# Altium schematic sheet NET.SchDoc
size 558 x 431 mm
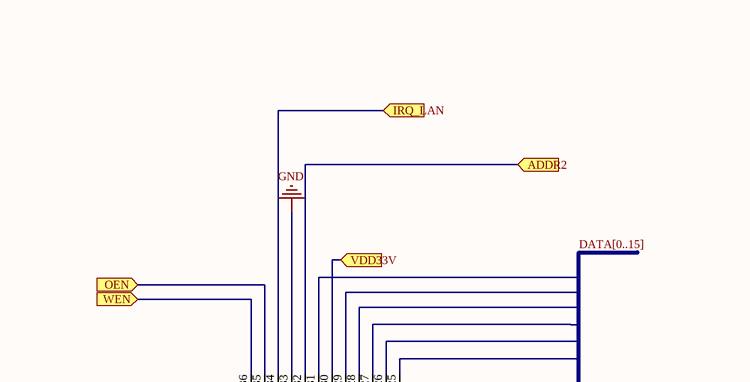
[diagram p0: NET.SchDoc, top left]
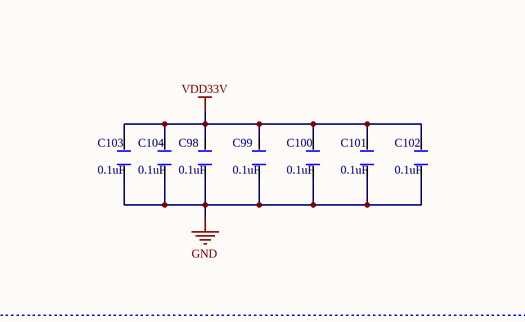
[diagram p1: NET.SchDoc, top right]
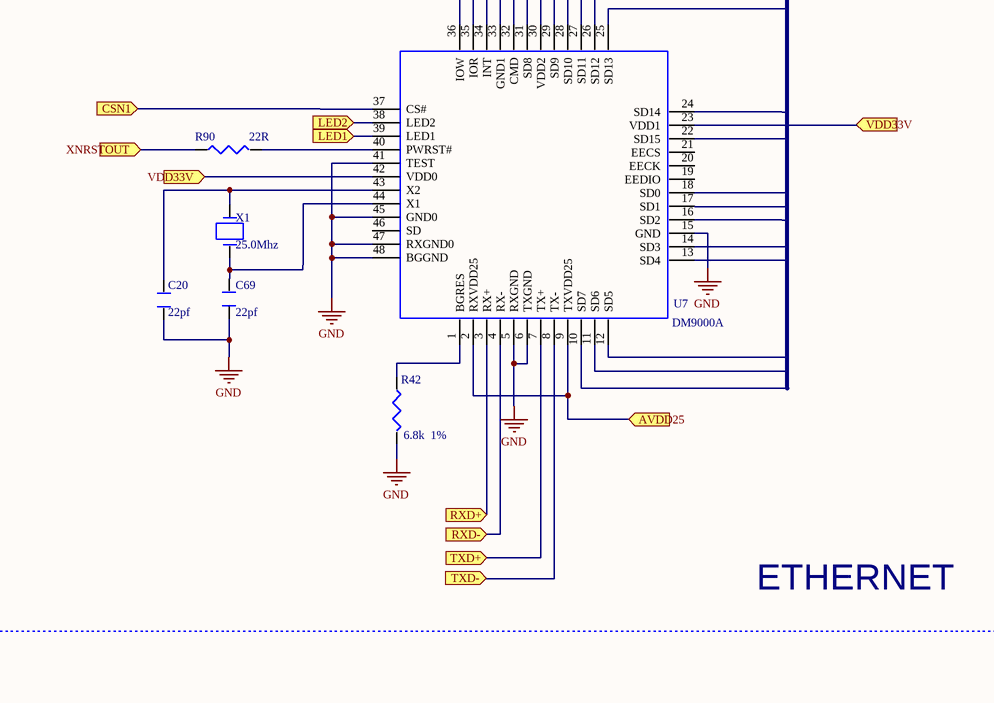
[diagram p2: NET.SchDoc, bottom left]
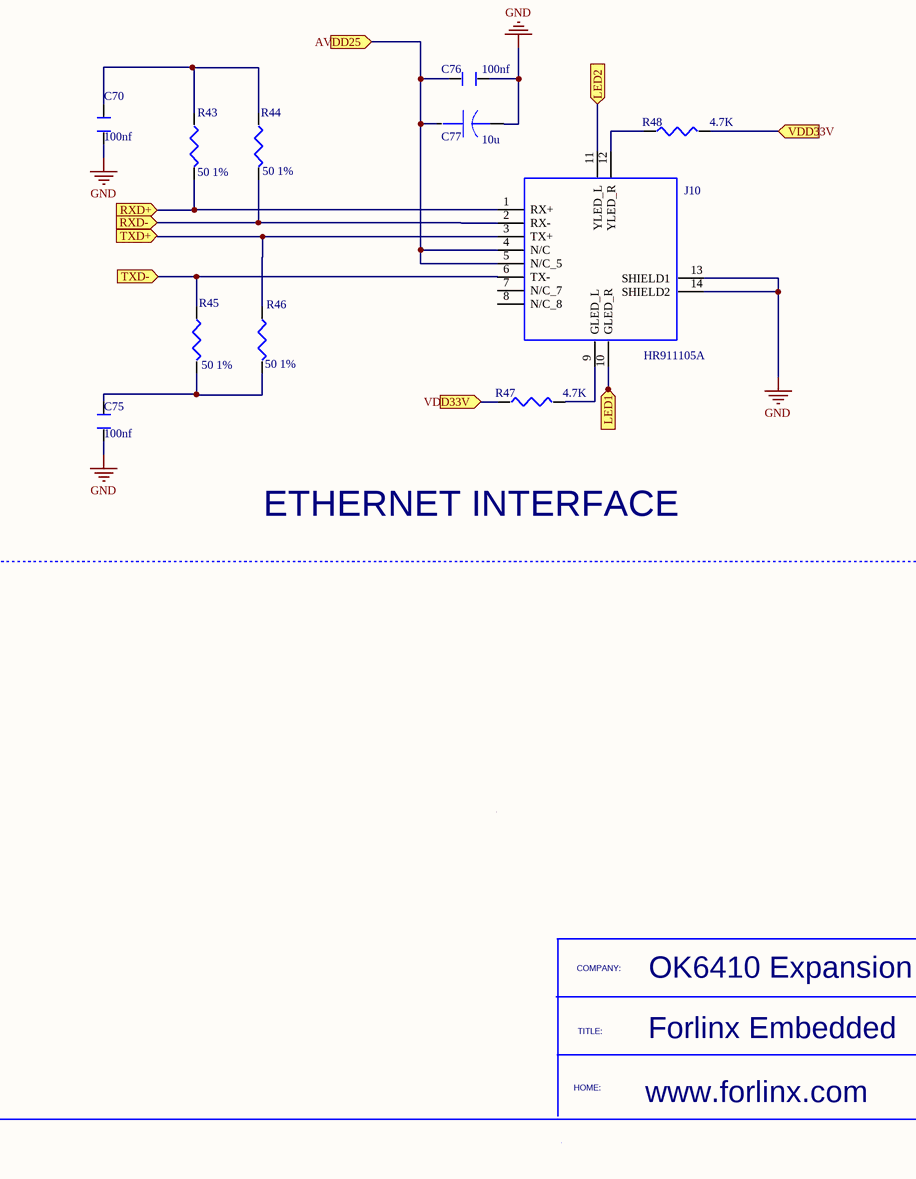
[diagram p3: NET.SchDoc, bottom right]

## Parts
C20  value 22pf  (hidden comment: C_0)
C69  value 22pf  (hidden comment: C_0)
C70  value 100nf  (hidden comment: C_0)
C75  value 100nf  (hidden comment: C_0)
C76  value 100nf  (hidden comment: C_0)
C77  value 10u  (hidden comment: CAP-AE4)
C98  value 0.1uF  (hidden comment: C_0)
C99  value 0.1uF  (hidden comment: C_0)
C100  value 0.1uF  (hidden comment: C_0)
C101  value 0.1uF  (hidden comment: C_0)
C102  value 0.1uF  (hidden comment: C_0)
C103  value 0.1uF  (hidden comment: C_0)
C104  value 0.1uF  (hidden comment: C_0)
J10  HR911105A
R42  value 6.8k  1%  (hidden comment: R_0)
R43  value 50 1%  (hidden comment: R_0)
R44  value 50 1%  (hidden comment: R_0)
R45  value 50 1%  (hidden comment: R_0)
R46  value 50 1%  (hidden comment: R_0)
R47  value 4.7K  (hidden comment: R_0)
R48  value 4.7K  (hidden comment: R_0)
R90  value 22R  (hidden comment: R_0)
U7  DM9000A
X1  value 25.0Mhz  (hidden comment: CRYSTALA)

## Blocks framed on the sheet
ETHERNET: C20 C69 R42 R90 U7 X1
ETHERNET INTERFACE: C70 C75-C77 J10 R43-R48

## Ports
ADDR2, AVDD25, CSN1, IRQ_LAN, LED1, LED2, OEN, RXD+, RXD-, TXD+, TXD-, VDD33V, WEN, XNRSTOUT

## Nets
GND: C20.1 C69.1 C70.1 C75.1 C76.1 C77.2 C98.1 C99.1 C100.1 C101.1 C102.1 C103.1 C104.1 J10.13(SHIELD1) J10.14(SHIELD2) R42.2 U7.5(RXGND) U7.6(TXGND) U7.15(GND) U7.33(GND1) U7.41(TEST) U7.45(GND0) U7.47(RXGND0) U7.48(BGGND)
VDD33V: C98.2 C99.2 C100.2 C101.2 C102.2 C103.2 C104.2
ADDR2: U7.32(CMD) ; port ADDR2
AVDD25: C76.2 C77.1 J10.4(N/C) J10.5(N/C_5) U7.2(RXVDD25) U7.9(TXVDD25) ; port AVDD25
CSN1: U7.37(CS#) ; port CSN1
IRQ_LAN: U7.34(INT) ; port IRQ_LAN
LED1: J10.10(GLED_R) U7.39(LED1) ; port LED1
LED2: J10.11(YLED_L) U7.38(LED2) ; port LED2
OEN: U7.35(IOR) ; port OEN
RXD+: J10.1(RX+) R43.2 U7.3(RX+) ; port RXD+
RXD-: J10.2(RX-) R44.2 U7.4(RX-) ; port RXD-
TXD+: J10.3(TX+) R46.1 U7.7(TX+) ; port TXD+
TXD-: J10.6(TX-) R45.1 U7.8(TX-) ; port TXD-
VDD33V: R47.1 R48.2 U7.23(VDD1) U7.30(VDD2) U7.42(VDD0) ; port VDD33V  [a separate net that carries the same name]
WEN: U7.36(IOW) ; port WEN
XNRSTOUT: R90.1 ; port XNRSTOUT
NetC20_2: C20.2 U7.43(X2) X1.2
NetC69_2: C69.2 U7.44(X1) X1.1
NetC70_2: C70.2 R43.1 R44.1
NetC75_2: C75.2 R45.2 R46.2
NetJ10_9: J10.9(GLED_L) R47.2
NetJ10_12: J10.12(YLED_R) R48.1
NetR42_1: R42.1 U7.1(BGRES)
NetR90_2: R90.2 U7.40(PWRST#)

Not connected (* = marked no-connect by the designer): J10 7(N/C_7) 8(N/C_8); U7 10(SD7) 11(SD6) 12(SD5) 13(SD4) 14(SD3) 16(SD2) 17(SD1) 18(SD0) 19(EEDIO) 20(EECK) 21(EECS) 22(SD15) 24(SD14) 25(SD13) 26(SD12) 27(SD11) 28(SD10) 29(SD9) 31(SD8) 46(SD)

## Buses and harness runs
bus DATA[0..15]

## Notes on the sheet
- COMPANY:
- TITLE:
- OK6410 Expansion Board
- HOME:
- Forlinx Embedded
- www.forlinx.com

## Library data of the parts
C20 C69 C70 C75 C76 C98-C104 = C_0: PCB Footprint: CM75; PCB DECAL: 0603A
C77 = CAP-AE4: ALUMINUM ELECTROLYTIC CAP.; Manufacturer #1: IPC SM-782 STD.; PCB DECAL: 3216A
J10 = HR911105A: PCB DECAL: RJ-45A12
R42-R48 R90 = R_0: PCB Footprint: C2012; PCB DECAL: 0603A
U7 = DM9000A: PCB DECAL: DM9000AE
X1 = CRYSTALA: PCB Footprint: X-C; PCB DECAL: OSC2PR-1